# Altium schematic sheet DDFK.SchDoc: AC Fan Controler By Bluetooth
size A4; CompanyName: AtoA; DrawnBy: Kasaee,Behboodi; Engineer: Kasaee,Behboodi; Revision: 1.0; SheetNumber: 1; SheetTotal: 1; ProjectName: AC Fan Controler By Bluetooth; Rule: PcbType=ProtelPcb
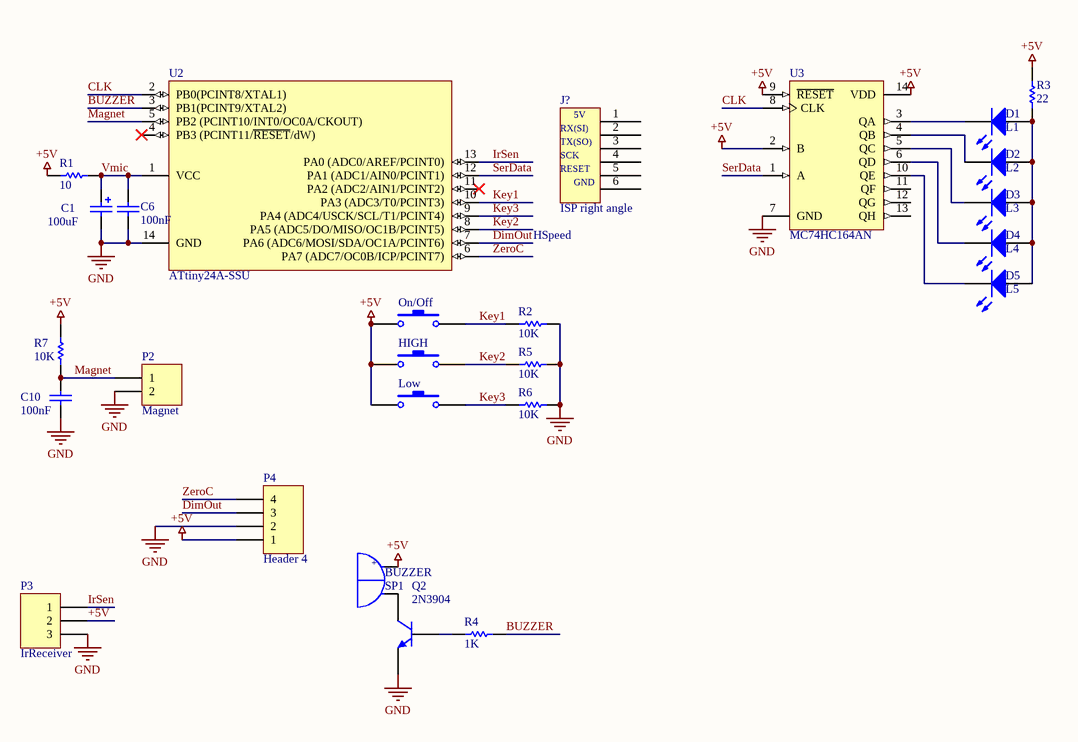
[diagram p0: DDFK.SchDoc]

## Parts
C1  100uF  [RB.15/.2]
C6  100nF  [RAD0.2]
C10  100nF  [RAD0.2]
D1  L1  [LED0.5Rec]
D2  L2  [LED0.5Rec]
D3  L3  [LED0.5Rec]
D4  L4  [LED0.5Rec]
D5  L5  [LED0.5Rec]
J?  ISP right angle  [AVRISP6]
P2  Magnet  [Magnet]
P3  IrReceiver  [IrRec1]
P4  Header 4  [xH4RA]
Q2  2N3904  [TO92BS2]
R1  10  [RES0.35]
R2  10K  [RES0.35]
R3  22  [RES0.35]
R4  1K  [RES0.35]
R5  10K  [RES0.35]
R6  10K  [RES0.35]
R7  10K  [RES0.35]
S1  On/Off  [PUSHBOT2]
S2  HIGH  [PUSHBOT2]
S3  Low  [PUSHBOT2]
SP1  BUZZER  [RB.3/.6]
U2  ATtiny24A-SSU  [SOIC14]
U3  MC74HC164AN  [SOIC14]

## Nets
+5V: P3.2 P4.1 R1.2 R3.1 R7.2 S1.1 S2.1 S3.1 SP1.1 U3.2(B) U3.9(~{RESET}) U3.14(VDD)
GND: C1.2 C6.1 C10.1 P2.2 P3.3 P4.2 Q2.3(E) R2.1 R5.1 R6.1 U2.14(GND) U3.7(GND)
BUZZER: R4.1 U2.3(PB1(PCINT9/XTAL2))
CLK: U2.2(PB0(PCINT8/XTAL1)) U3.8(CLK)
DimOut: P4.3 U2.7(PA6_(ADC6/MOSI/SDA/OC1A/PCINT6))
IrSen: P3.1 U2.13(PA0_(ADC0/AREF/PCINT0))
Key1: R2.2 S1.2 U2.10(PA3_(ADC3/T0/PCINT3))
Key2: R5.2 S2.2 U2.8(PA5_(ADC5/DO/MISO/OC1B/PCINT5))
Key3: R6.2 S3.2 U2.9(PA4_(ADC4/USCK/SCL/T1/PCINT4))
Magnet: C10.2 P2.1 R7.1 U2.5(PB2_(PCINT10/INT0/OC0A/CKOUT))
SerData: U2.12(PA1_(ADC1/AIN0/PCINT1)) U3.1(A)
Vmic: C1.1 C6.2 R1.1 U2.1(VCC)
ZeroC: P4.4 U2.6(PA7_(ADC7/OC0B/ICP/PCINT7))
NetD1_1: D1.1(A) D2.1(A) D3.1(A) D4.1(A) D5.1(A) R3.2
NetD1_2: D1.2(K) U3.3(QA)
NetD2_2: D2.2(K) U3.4(QB)
NetD3_2: D3.2(K) U3.5(QC)
NetD4_2: D4.2(K) U3.6(QD)
NetD5_2: D5.2(K) U3.10(QE)
NetQ2_1: Q2.1(B) R4.2
NetQ2_2: Q2.2(C) SP1.2

Not connected (* = marked no-connect by the designer): J? 1 2 3 4 5 6; U2 4(PB3_(PCINT11/~{RESET}/dW))* 11(PA2_(ADC2/AIN1/PCINT2))*; U3 11(QF) 12(QG) 13(QH)

## Notes on the sheet
- (near J?) HSpeed
- Title
- Size:
- Date:
- A4
- Number:
- Time:
- Revision:
- Sheet
- of
- File:
- (in symbol AVRISP6) 5V; RX(SI); TX(SO); SCK; RESET; GND
- (in symbol BUZZER) +

## Library data of the parts
C1 = Cap Pol: Polarized Capacitor; Value: 100pF; Published: 8-Jun-2000; LatestRevisionDate: 17-Jul-2002; LatestRevisionNote: Re-released for DXP Platform.; PackageReference: RB7.6-15; Publisher: Altium Limited
C6 = Cap: Capacitor; Value: 100pF; Published: 8-Jun-2000; LatestRevisionDate: 17-Jul-2002; LatestRevisionNote: Re-released for DXP Platform.; PackageReference: RAD-0.3; Publisher: Altium Limited
C10 = Cap: Capacitor SMD; Value: 100pF; Published: 8-Jun-2000; LatestRevisionDate: 17-Jul-2002; LatestRevisionNote: Re-released for DXP Platform.; PackageReference: RAD-0.3; Publisher: Altium Limited
D1-D5 = LED0.5: LED Radial 0.5; Published: 8-Jun-2000; LatestRevisionDate: 17-Dec-2003; LatestRevisionNote: PCB Footprint replaced.; DatasheetDocument: 16-Apr-2002; PackageDocument: 16-Apr-2002; PackageReference: 3.5X2.8X1.9; Publisher: Altium Limited
J? = AVRISP6: Text Field1: 20; Text Field2: 70
P2 = Header 2: Header, 2-Pin; LatestRevisionDate: 17-Jul-2002; LatestRevisionNote: Re-released for DXP Platform.; Publisher: Altium Limited
P3 = Header 3: 3pin; LatestRevisionDate: 17-Jul-2002; LatestRevisionNote: Re-released for DXP Platform.; Publisher: Altium Limited
P4 = Header 4: Header, 4-Pin; LatestRevisionDate: 17-Jul-2002; LatestRevisionNote: Re-released for DXP Platform.; Publisher: Altium Limited
Q2 = BC337: NPN General Purpose Amplifier; Published: 8-Jun-2000; LatestRevisionDate: 15-Jan-2003; LatestRevisionNote: PCB Footprint 'BCY-W3/D4.7' replaced; DatasheetDocument: 1997; PackageDocument: Sep-1998; PackageReference: TO-92A; Publisher: Altium Limited; Code_JEDEC: TO-92A; ComponentLink1Description: Manufacturer Link; ComponentLink1URL: http://www.fairchildsemi.com/; ComponentLink2Description: Datasheet; ComponentLink2URL: http://www.fairchildsemi.com/ds/2N%2F2N3904.pdf
R1-R7 = Resistor: Published: 8-Jun-2000; LatestRevisionDate: 17-Jul-2002; LatestRevisionNote: Re-released for DXP Platform.; PackageReference: AXIAL-0.5; Publisher: Altium Limited
S1-S3 = SW-PB: 6x6x7; Published: 24-Mar-1999; LatestRevisionDate: 17-Jul-2002; LatestRevisionNote: Re-released for DXP Platform.; PackageReference: SPST-2; Publisher: Altium Limited
SP1 = BUZZER: 5Volt; Text Field1: 40; Text Field2: 20
U2 = ATtiny24-16PC: 8-Bit AVR Microcontroller with 2K Bytes of Flash Memory; Published: 17-Sep-2003; LatestRevisionDate: 04-Mar-2005; LatestRevisionNote: Stylized 3D Model Added.; DatasheetVersion: 1477C-AVR-09/02; PackageVersion: Aug-1999; PackageReference: 20P3; Publisher: Altium Limited; PackageDescription: DIP; 20 Leads; Row Spacing 7.62 mm; Pitch 2.54 mm; Code_JEDEC: MS-001-AD; ComponentLink1Description: Manufacturer Link; ComponentLink1URL: http://www.atmel.com; ComponentLink2Description: Datasheet; ComponentLink2URL: http://www.atmel.com/dyn/resources/prod_documents/doc1477.pdf
U3 = MC74HC164AN: 8-Bit Serial Input / Parallel-Output Shift Register; Published: 15-Apr-2002; DatasheetVersion: Mar-2000; PackageVersion: 1995; PackageReference: 646-06; Publisher: Altium Limited; PackageDescription: DIP; 14 Leads; Row Spacing 7.62 mm; Pitch 2.54 mm; ComponentLink1Description: Manufacturer Link; ComponentLink1URL: http://www.onsemi.com/; ComponentLink2Description: Datasheet; ComponentLink2URL: http://www.onsemi.com/pub/Collateral/MC74HC164A-D.PDF